# Altium schematic sheet sonar_peripherals.SchDoc
size A
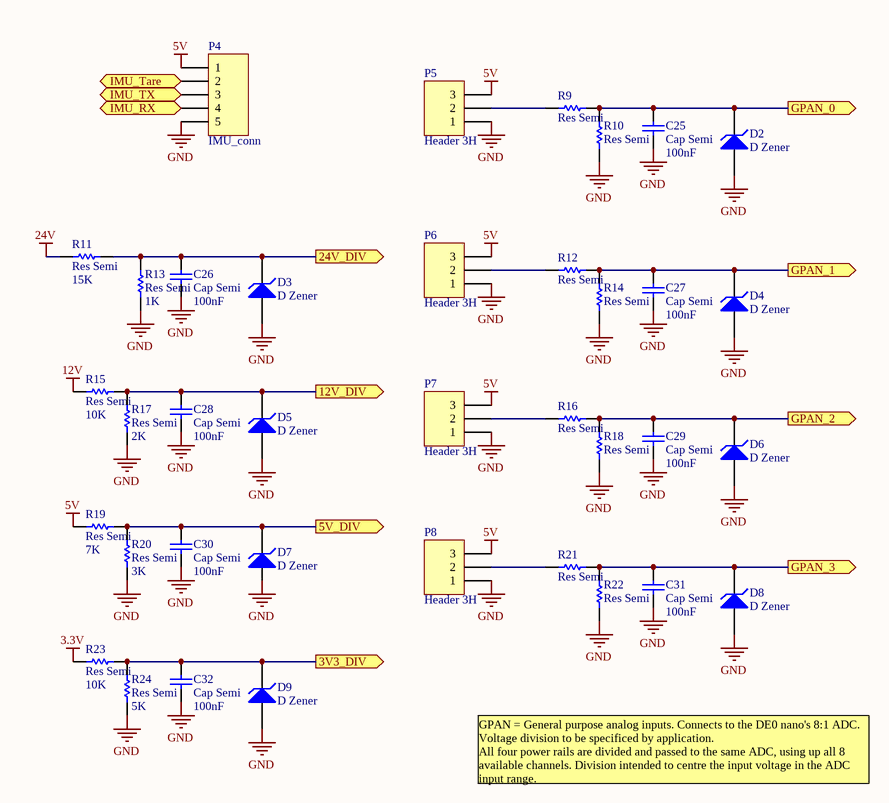
[diagram p0: sonar_peripherals.SchDoc]

## Parts
C25  Cap Semi  value 100nF  [C0805]
C26  Cap Semi  value 100nF  [C0805]
C27  Cap Semi  value 100nF  [C0805]
C28  Cap Semi  value 100nF  [C0805]
C29  Cap Semi  value 100nF  [C0805]
C30  Cap Semi  value 100nF  [C0805]
C31  Cap Semi  value 100nF  [C0805]
C32  Cap Semi  value 100nF  [C0805]
D2  D Zener  [SOD-323]
D3  D Zener  [SOD-323]
D4  D Zener  [SOD-323]
D5  D Zener  [SOD-323]
D6  D Zener  [SOD-323]
D7  D Zener  [SOD-323]
D8  D Zener  [SOD-323]
D9  D Zener  [SOD-323]
P4  IMU_conn  [HDR1X5H]
P5  Header 3H  [HDR1X3H]
P6  Header 3H  [HDR1X3H]
P7  Header 3H  [HDR1X3H]
P8  Header 3H  [HDR1X3H]
R9  Res Semi  [RESC2012L]
R10  Res Semi  [RESC2012L]
R11  Res Semi  value 15K  [RESC2012L]
R12  Res Semi  [RESC2012L]
R13  Res Semi  value 1K  [RESC2012L]
R14  Res Semi  [RESC2012L]
R15  Res Semi  value 10K  [RESC2012L]
R16  Res Semi  [RESC2012L]
R17  Res Semi  value 2K  [RESC2012L]
R18  Res Semi  [RESC2012L]
R19  Res Semi  value 7K  [RESC2012L]
R20  Res Semi  value 3K  [RESC2012L]
R21  Res Semi  [RESC2012L]
R22  Res Semi  [RESC2012L]
R23  Res Semi  value 10K  [RESC2012L]
R24  Res Semi  value 5K  [RESC2012L]

## Ports
3V3_DIV (out), 5V_DIV (out), 12V_DIV (out), 24V_DIV (out), GPAN_0 (out), GPAN_1 (out), GPAN_2 (out), GPAN_3 (out), IMU_RX (in), IMU_Tare (in), IMU_TX (out)

## Nets
3.3V: R23.1
5V: P4.1 P5.3 P6.3 P7.3 P8.3 R19.1
12V: R15.1
24V: R11.1
GND: C25.1 C26.1 C27.1 C28.1 C29.1 C30.1 C31.1 C32.1 D2.1(A) D3.1(A) D4.1(A) D5.1(A) D6.1(A) D8.1(A) D9.1(A) P4.5 P5.1 P6.1 P7.1 P8.1 R10.1 R13.1 R14.1 R17.1 R18.1 R20.1 R22.1 R24.1
3V3_DIV: C32.2 D9.2(K) R23.2 R24.2 ; port 3V3_DIV
5V_DIV: C30.2 D7.2(K) R19.2 R20.2 ; port 5V_DIV
12V_DIV: C28.2 D5.2(K) R15.2 R17.2 ; port 12V_DIV
24V_DIV: C26.2 D3.2(K) R11.2 R13.2 ; port 24V_DIV
GPAN_0: C25.2 D2.2(K) R9.2 R10.2 ; port GPAN_0
GPAN_1: C27.2 D4.2(K) R12.2 R14.2 ; port GPAN_1
GPAN_2: C29.2 D6.2(K) R16.2 R18.2 ; port GPAN_2
GPAN_3: C31.2 D8.2(K) R21.2 R22.2 ; port GPAN_3
IMU_RX: P4.4 ; port IMU_RX
IMU_Tare: P4.2 ; port IMU_Tare
IMU_TX: P4.3 ; port IMU_TX
NetP5_2: P5.2 R9.1
NetP6_2: P6.2 R12.1
NetP7_2: P7.2 R16.1
NetP8_2: P8.2 R21.1

Not connected (* = marked no-connect by the designer): D7 1(A)

## Notes on the sheet
- GPAN = General purpose analog inputs. Connects to the DE0 nano's 8:1 ADC.  Voltage division to be specificed by application.
  All four power rails are divided and passed to the same ADC, using up all 8 available channels. Division intended to centre the input voltage in the ADC input range.
- Labels drawn without touching a wire or pin: GND

## Library data of the parts
C25-C32 = Cap Semi: Capacitor (Semiconductor SIM Model); Published: 8-Jun-2000; LatestRevisionDate: 29-May-2009; LatestRevisionNote: IPC-7351 Footprint Added.; PackageReference: C1206; Publisher: Altium Limited; PackageDescription: Chip Capacitor
D2-D9 = D Zener: Zener Diode; Published: 8-Jun-2000; LatestRevisionDate: 17-Jul-2002; LatestRevisionNote: Re-released for DXP Platform.; PackageReference: DIODE-0.7; Publisher: Altium Limited; PackageDescription: Diode, Thru-Hole; 2 Leads; 0.7 in Pin Spacing
P4 = Header 5H: Header, 5-Pin, Right Angle; LatestRevisionDate: 17-Jul-2002; LatestRevisionNote: Re-released for DXP Platform.; Publisher: Altium Limited
P5-P8 = Header 3H: Header, 3-Pin, Right Angle; LatestRevisionDate: 17-Jul-2002; LatestRevisionNote: Re-released for DXP Platform.; Publisher: Altium Limited
R9 R12 R16 R21 = Res Semi: Semiconductor Resistor; Value: 10K; Published: 8-Jun-2000; LatestRevisionDate: 17-Jul-2002; LatestRevisionNote: Re-released for DXP Platform.; PackageReference: AXIAL-0.5; Publisher: Altium Limited; PackageDescription: Axial Device, Thru-Hole; 2 Leads; 0.5 in Pin Spacing
R10 R14 R18 R22 = Res Semi: Semiconductor Resistor; Value: 2K; Published: 8-Jun-2000; LatestRevisionDate: 17-Jul-2002; LatestRevisionNote: Re-released for DXP Platform.; PackageReference: AXIAL-0.5; Publisher: Altium Limited; PackageDescription: Axial Device, Thru-Hole; 2 Leads; 0.5 in Pin Spacing
R11 R13 R15 R17 R19 R20 R23 R24 = Res Semi: Semiconductor Resistor; Published: 8-Jun-2000; LatestRevisionDate: 17-Jul-2002; LatestRevisionNote: Re-released for DXP Platform.; PackageReference: AXIAL-0.5; Publisher: Altium Limited; PackageDescription: Axial Device, Thru-Hole; 2 Leads; 0.5 in Pin Spacing